# EAGLE design MotorShield (EAGLE 6.6.0)
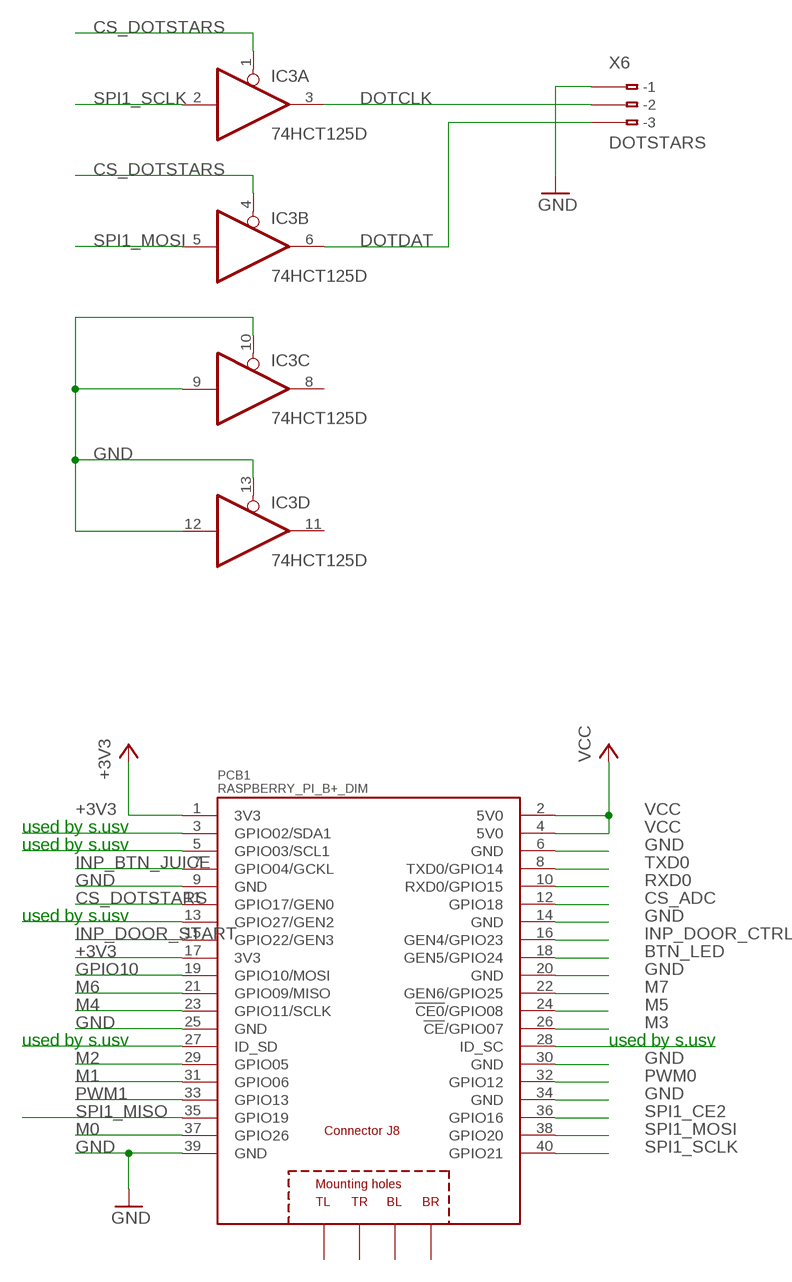
[diagram p0: schematic, sheet 1, part 1 of 2]
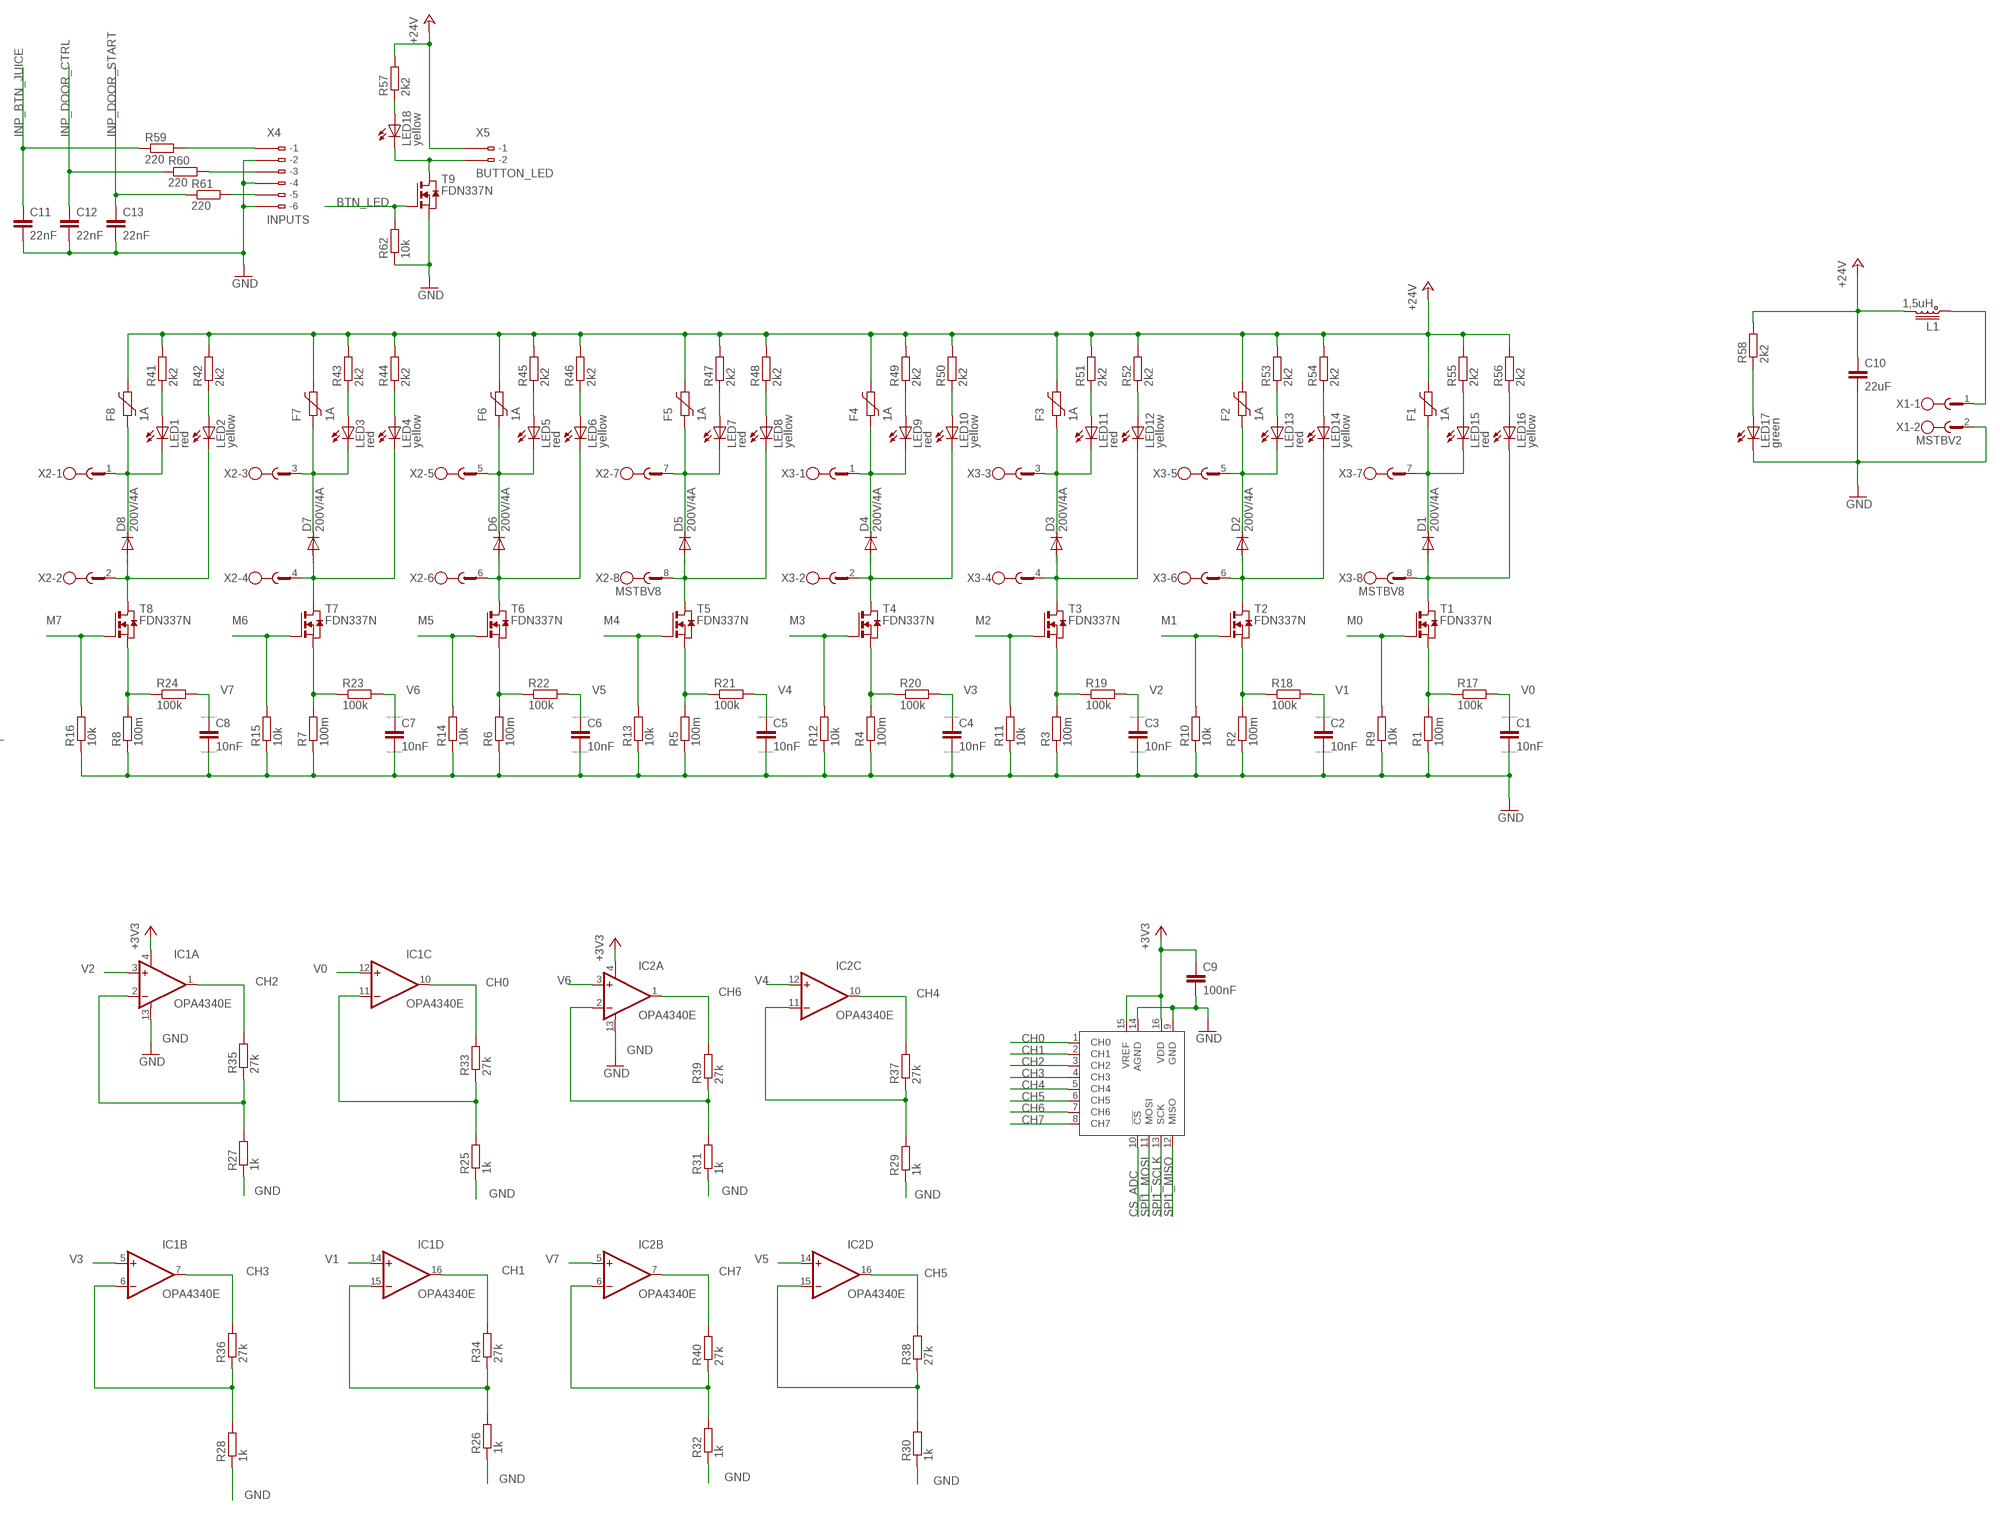
[diagram p1: schematic, sheet 1, part 2 of 2]

## Parts
C1  10nF  C  [C0805]
C2  10nF  C  [C0805]
C3  10nF  C  [C0805]
C4  10nF  C  [C0805]
C5  10nF  C  [C0805]
C6  10nF  C  [C0805]
C7  10nF  C  [C0805]
C8  10nF  C  [C0805]
C9  100nF  C-EUC0805  [C0805]
C10  22uF  C-EUC1812  [C1812]
C11  22nF  C-EUC0805K  [C0805K]
C12  22nF  C-EUC0805K  [C0805K]
C13  22nF  C-EUC0805K  [C0805K]
D1  200V/4A  DIODE-DO214AA  [DO214AA]
D2  200V/4A  DIODE-DO214AA  [DO214AA]
D3  200V/4A  DIODE-DO214AA  [DO214AA]
D4  200V/4A  DIODE-DO214AA  [DO214AA]
D5  200V/4A  DIODE-DO214AA  [DO214AA]
D6  200V/4A  DIODE-DO214AA  [DO214AA]
D7  200V/4A  DIODE-DO214AA  [DO214AA]
D8  200V/4A  DIODE-DO214AA  [DO214AA]
F1  1A  1812L  [1812L]
F2  1A  1812L  [1812L]
F3  1A  1812L  [1812L]
F4  1A  1812L  [1812L]
F5  1A  1812L  [1812L]
F6  1A  1812L  [1812L]
F7  1A  1812L  [1812L]
F8  1A  1812L  [1812L]
IC1  OPA4340E  [SSOP16BU]
IC2  OPA4340E  [SSOP16BU]
IC3  74HCT125D  [SO14]
IC4  MCP3008SL  [SO16]
L1  1,5uH  MPI4040R3-1R5-R  [MPI4040]
LED1  red  LEDCHIP-LED0805  [CHIP-LED0805]
LED2  yellow  LEDCHIP-LED0805  [CHIP-LED0805]
LED3  red  LEDCHIP-LED0805  [CHIP-LED0805]
LED4  yellow  LEDCHIP-LED0805  [CHIP-LED0805]
LED5  red  LEDCHIP-LED0805  [CHIP-LED0805]
LED6  yellow  LEDCHIP-LED0805  [CHIP-LED0805]
LED7  red  LEDCHIP-LED0805  [CHIP-LED0805]
LED8  yellow  LEDCHIP-LED0805  [CHIP-LED0805]
LED9  red  LEDCHIP-LED0805  [CHIP-LED0805]
LED10  yellow  LEDCHIP-LED0805  [CHIP-LED0805]
LED11  red  LEDCHIP-LED0805  [CHIP-LED0805]
LED12  yellow  LEDCHIP-LED0805  [CHIP-LED0805]
LED13  red  LEDCHIP-LED0805  [CHIP-LED0805]
LED14  yellow  LEDCHIP-LED0805  [CHIP-LED0805]
LED15  red  LEDCHIP-LED0805  [CHIP-LED0805]
LED16  yellow  LEDCHIP-LED0805  [CHIP-LED0805]
LED17  green  LEDCHIP-LED0805  [CHIP-LED0805]
LED18  yellow  LEDCHIP-LED0805  [CHIP-LED0805]
PCB1  RASPBERRY_PI_B+_DIM  [RASPBERRY_PI_BPLUS_DIM]
R1  100m  R-EU_R0805  [R0805]
R2  100m  R-EU_R0805  [R0805]
R3  100m  R-EU_R0805  [R0805]
R4  100m  R-EU_R0805  [R0805]
R5  100m  R-EU_R0805  [R0805]
R6  100m  R-EU_R0805  [R0805]
R7  100m  R-EU_R0805  [R0805]
R8  100m  R-EU_R0805  [R0805]
R9  10k  R-EU_R0805  [R0805]
R10  10k  R-EU_R0805  [R0805]
R11  10k  R-EU_R0805  [R0805]
R12  10k  R-EU_R0805  [R0805]
R13  10k  R-EU_R0805  [R0805]
R14  10k  R-EU_R0805  [R0805]
R15  10k  R-EU_R0805  [R0805]
R16  10k  R-EU_R0805  [R0805]
R17  100k  R-EU_R0805  [R0805]
R18  100k  R-EU_R0805  [R0805]
R19  100k  R-EU_R0805  [R0805]
R20  100k  R-EU_R0805  [R0805]
R21  100k  R-EU_R0805  [R0805]
R22  100k  R-EU_R0805  [R0805]
R23  100k  R-EU_R0805  [R0805]
R24  100k  R-EU_R0805  [R0805]
R25  1k  R-EU_R0805  [R0805]
R26  1k  R-EU_R0805  [R0805]
R27  1k  R-EU_R0805  [R0805]
R28  1k  R-EU_R0805  [R0805]
R29  1k  R-EU_R0805  [R0805]
R30  1k  R-EU_R0805  [R0805]
R31  1k  R-EU_R0805  [R0805]
R32  1k  R-EU_R0805  [R0805]
R33  27k  R-EU_R0805  [R0805]
R34  27k  R-EU_R0805  [R0805]
R35  27k  R-EU_R0805  [R0805]
R36  27k  R-EU_R0805  [R0805]
R37  27k  R-EU_R0805  [R0805]
R38  27k  R-EU_R0805  [R0805]
R39  27k  R-EU_R0805  [R0805]
R40  27k  R-EU_R0805  [R0805]
R41  2k2  R-EU_R0805  [R0805]
R42  2k2  R-EU_R0805  [R0805]
R43  2k2  R-EU_R0805  [R0805]
R44  2k2  R-EU_R0805  [R0805]
R45  2k2  R-EU_R0805  [R0805]
R46  2k2  R-EU_R0805  [R0805]
R47  2k2  R-EU_R0805  [R0805]
R48  2k2  R-EU_R0805  [R0805]
R49  2k2  R-EU_R0805  [R0805]
R50  2k2  R-EU_R0805  [R0805]
R51  2k2  R-EU_R0805  [R0805]
R52  2k2  R-EU_R0805  [R0805]
R53  2k2  R-EU_R0805  [R0805]
R54  2k2  R-EU_R0805  [R0805]
R55  2k2  R-EU_R0805  [R0805]
R56  2k2  R-EU_R0805  [R0805]
R57  2k2  R-EU_R0805  [R0805]
R58  2k2  R-EU_R0805  [R0805]
R59  220  R-EU_R0805  [R0805]
R60  220  R-EU_R0805  [R0805]
R61  220  R-EU_R0805  [R0805]
R62  10k  R-EU_R0805  [R0805]
T1  FDN337N  NMOSSOT23  [SOT-23]
T2  FDN337N  NMOSSOT23  [SOT-23]
T3  FDN337N  NMOSSOT23  [SOT-23]
T4  FDN337N  NMOSSOT23  [SOT-23]
T5  FDN337N  NMOSSOT23  [SOT-23]
T6  FDN337N  NMOSSOT23  [SOT-23]
T7  FDN337N  NMOSSOT23  [SOT-23]
T8  FDN337N  NMOSSOT23  [SOT-23]
T9  FDN337N  NMOSSOT23  [SOT-23]
X1  MSTBV2  [MSTBV2]
X2  MSTBV8  [MSTBV8]
X3  MSTBV8  [MSTBV8]
X4  INPUTS  233-506  [233-506]
X5  BUTTON_LED  233-502  [233-502]
X6  DOTSTARS  233-503  [233-503]

## Nets
+3V3: C9.1 IC1.4(A:V+) IC2.4(A:V+) IC4.15(VREF) IC4.16(VDD) PCB1.1(3V3) PCB1.17(3V3)
+24V [motor 2A]: C10.1 F1.2 F2.2 F3.2 F4.2 F5.2 F6.2 F7.2 F8.2 L1.2 R41.2 R42.2 R43.2 R44.2 R45.2 R46.2 R47.2 R48.2 R49.2 R50.2 R51.2 R52.2 R53.2 R54.2 R55.2 R56.2 R57.2 R58.2 X5.B1(B-1)
BTN_LED: PCB1.18(GEN5/GPIO24) R62.2 T9.3(G)
CH0: IC1.10(C:OUT) IC4.1(CH0) R33.2
CH1: IC1.16(D:OUT) IC4.2(CH1) R34.2
CH2: IC1.1(A:OUT) IC4.3(CH2) R35.2
CH3: IC1.7(B:OUT) IC4.4(CH3) R36.2
CH4: IC2.10(C:OUT) IC4.5(CH4) R37.2
CH5: IC2.16(D:OUT) IC4.6(CH5) R38.2
CH6: IC2.1(A:OUT) IC4.7(CH6) R39.2
CH7: IC2.7(B:OUT) IC4.8(CH7) R40.2
CS_ADC: IC4.10(!CS) PCB1.12(GPIO18)
CS_DOTSTARS: IC3.1(A:OE) IC3.4(B:OE) PCB1.11(GPIO17/GEN0)
D8 [motor 2A]: D8.C F8.1 LED1.C X2.1
DOTCLK: IC3.3(A:O) X6.B2(B-2)
DOTDAT: IC3.6(B:O) X6.B3(B-3)
GND: C1.2 C2.2 C3.2 C4.2 C5.2 C6.2 C7.2 C8.2 C9.2 C10.2 C11.2 C12.2 C13.2 IC1.13(A:V-) IC2.13(A:V-) IC3.9(C:I) IC3.10(C:OE) IC3.12(D:I) IC3.13(D:OE) IC4.9(GND) IC4.14(AGND) LED17.C PCB1.6(GND) PCB1.9(GND) PCB1.14(GND) PCB1.20(GND) PCB1.25(GND) PCB1.30(GND) PCB1.34(GND) PCB1.39(GND) R1.1 R2.1 R3.1 R4.1 R5.1 R6.1 R7.1 R8.1 R9.1 R10.1 R11.1 R12.1 R13.1 R14.1 R15.1 R16.1 R25.1 R26.1 R27.1 R28.1 R29.1 R30.1 R31.1 R32.1 R62.1 T9.2(S) X1.2 X4.B2(B-2) X4.B4(B-4) X4.B6(B-6) X6.B1(B-1)
GPIO10: PCB1.19(GPIO10/MOSI)
GPIO27: PCB1.13(GPIO27/GEN2)
INP_BTN_JUICE: C11.1 PCB1.7(GPIO04/GCKL) R59.1
INP_DOOR_CTRL: C12.1 PCB1.16(GEN4/GPIO23) R60.1
INP_DOOR_START: C13.1 PCB1.15(GPIO22/GEN3) R61.1
M0: PCB1.37(GPIO26) R9.2 T1.3(G)
M1: PCB1.31(GPIO06) R10.2 T2.3(G)
M2: PCB1.29(GPIO05) R11.2 T3.3(G)
M3: PCB1.26(!CE!/GPIO07) R12.2 T4.3(G)
M4: PCB1.23(GPIO11/SCLK) R13.2 T5.3(G)
M5: PCB1.24(!CE0!/GPIO08) R14.2 T6.3(G)
M6: PCB1.21(GPIO09/MISO) R15.2 T7.3(G)
M7: PCB1.22(GEN6/GPIO25) R16.2 T8.3(G)
N$2 [motor 2A]: D8.A LED2.C T8.1(D) X2.2
N$3 [motor 2A]: R8.2 R24.1 T8.2(S)
N$4 [motor 2A]: D1.C F1.1 LED15.C X3.7
N$5 [motor 2A]: D2.C F2.1 LED13.C X3.5
N$6: IC1.2(A:-IN) R27.2 R35.1
N$7 [motor 2A]: D3.C F3.1 LED11.C X3.3
N$8 [motor 2A]: D4.C F4.1 LED9.C X3.1
N$9 [motor 2A]: D5.C F5.1 LED7.C X2.7
N$10 [motor 2A]: D7.A LED4.C T7.1(D) X2.4
N$11 [motor 2A]: R7.2 R23.1 T7.2(S)
N$12 [motor 2A]: D6.C F6.1 LED5.C X2.5
N$13 [motor 2A]: D7.C F7.1 LED3.C X2.3
N$15: IC1.6(B:-IN) R28.2 R36.1
N$16: PCB1.3(GPIO02/SDA1)
N$17 [motor 2A]: D6.A LED6.C T6.1(D) X2.6
N$18 [motor 2A]: R6.2 R22.1 T6.2(S)
N$19: PCB1.27(ID_SD)
N$20: PCB1.28(ID_SC)
N$21: PCB1.5(GPIO03/SCL1)
N$22: IC1.11(C:-IN) R25.2 R33.1
N$23 [input 8A]: L1.1 X1.1
N$24: LED15.A R55.1
N$25: LED16.A R56.1
N$26 [motor 2A]: D5.A LED8.C T5.1(D) X2.8
N$27: IC1.15(D:-IN) R26.2 R34.1
N$28: LED1.A R41.1
N$29 [motor 2A]: R5.2 R21.1 T5.2(S)
N$30: LED2.A R42.1
N$31: IC2.2(A:-IN) R31.2 R39.1
N$32: LED18.C T9.1(D) X5.B2(B-2)
N$33: R59.2 X4.B1(B-1)
N$34: IC2.6(B:-IN) R32.2 R40.1
N$35: LED3.A R43.1
N$36: LED4.A R44.1
N$37: IC2.11(C:-IN) R29.2 R37.1
N$38 [motor 2A]: D4.A LED10.C T4.1(D) X3.2
N$39 [motor 2A]: R4.2 R20.1 T4.2(S)
N$40: IC2.15(D:-IN) R30.2 R38.1
N$41: LED6.A R46.1
N$42: LED5.A R45.1
N$43: LED7.A R47.1
N$44: LED8.A R48.1
N$45 [motor 2A]: D3.A LED12.C T3.1(D) X3.4
N$46 [motor 2A]: R3.2 R19.1 T3.2(S)
N$47: LED9.A R49.1
N$48: LED10.A R50.1
N$49: LED11.A R51.1
N$50: LED12.A R52.1
N$51 [motor 2A]: D2.A LED14.C T2.1(D) X3.6
N$52 [motor 2A]: R2.2 R18.1 T2.2(S)
N$53: LED13.A R53.1
N$54: LED14.A R54.1
N$57 [motor 2A]: D1.A LED16.C T1.1(D) X3.8
N$58 [motor 2A]: R1.2 R17.1 T1.2(S)
N$60: R60.2 X4.B3(B-3)
N$61: R61.2 X4.B5(B-5)
N$62: LED17.A R58.1
N$63: LED18.A R57.1
PWM0: PCB1.32(GPIO12)
PWM1: PCB1.33(GPIO13)
RXD0: PCB1.10(RXD0/GPIO15)
SPI1_CE2: PCB1.36(GPIO16)
SPI1_MISO: IC4.12(MISO) PCB1.35(GPIO19)
SPI1_MOSI: IC3.5(B:I) IC4.11(MOSI) PCB1.38(GPIO20)
SPI1_SCLK: IC3.2(A:I) IC4.13(SCK) PCB1.40(GPIO21)
TXD0: PCB1.8(TXD0/GPIO14)
V0: C1.1 IC1.12(C:+IN) R17.2
V1: C2.1 IC1.14(D:+IN) R18.2
V2: C3.1 IC1.3(A:+IN) R19.2
V3: C4.1 IC1.5(B:+IN) R20.2
V4: C5.1 IC2.12(C:+IN) R21.2
V5: C6.1 IC2.14(D:+IN) R22.2
V6: C7.1 IC2.3(A:+IN) R23.2
V7: C8.1 IC2.5(B:+IN) R24.2
VCC: PCB1.2(5V0) PCB1.4(5V0)
Unconnected: IC3.8(C:O) IC3.11(D:O) PCB1.PE_BL(BL) PCB1.PE_BR(BR) PCB1.PE_TL(TL) PCB1.PE_TR(TR) X4.A1(-1) X4.A2(-2) X4.A3(-3) X4.A4(-4) X4.A5(-5) X4.A6(-6) X5.A1(-1) X5.A2(-2) X6.A1(-1) X6.A2(-2) X6.A3(-3)

## Notes on the sheet
- used by s.usv
- used by s.usv
- used by s.usv
- used by s.usv | used by s.usv

## Power pins joined to a net without a drawn wire
GND: IC3.7(P:GND)
VCC: IC3.14(P:VCC)

## Library data of the parts
C1-C8 = eagle-ltspice:C: CAPACITOR, European symbol; SPICEMODEL: NONE; SPICEPREFIX: C
C9-C13 = rcl:C-EU: CAPACITOR, European symbol
D1-D8 = diode:DIODE-: DIODE
F1-F8 = ptc-littlefuse:1812L: FUSE
IC1 IC2 = burr-brown:OPA4340: Operational Amplifiers Source: http://focus.ti.com/lit/ds/sbos073/sbos073.pdf; MPN: OPA4340EA/250G4; OC_FARNELL: 1207061; OC_NEWARK: 67K8209
IC3 = 74xx-eu:74*125: Quad bus BUFFER, 3-state
IC4 = MCP3008:MCP3008
L1 = MPI4040:MPI4040R3-1R5-R: MPI4040R3-1R5-R; RS-COMPONENTS: 770-2738
LED1-LED18 = led:LED: LED OSRAM: - CHIPLED LG R971, LG N971, LY N971, LG Q971, LY Q971, LO R971, LY R971 LH N974, LH R974 LS Q976, LO Q976, LY Q976 LO Q996 - Hyper CHIPLED LW Q18S LB Q993, LB Q99A, LB R99A - SideLED LS A670, LO A670, LY A670, LG A670, LP A670 LB A673, LV A673, LT A673, LW A673 LH A674 LY A675 LS A676, LA A676, LO A676, LY A676, LW A676 LS A679, LY A679, LG A679 - Hyper Micro SIDELED® LS Y876, LA Y876, LO Y876, LY Y876 LT Y87S - SmartLED LW L88C, LW L88S LB L89C, LB L89S, LG L890 LS L89K, LO L89K, LY L89K LS L896, LA L896, LO L896, LY L896 - TOPLED LS T670, LO T670, LY T670, LG T670, LP T670 LSG T670, LSP T670, LSY T670, LOP T670, LYG T670 LG T671, LOG T671, LSG T671 LB T673, LV T673, LT T673, LW T673 LH T674 LS T676, LA T676, LO T676, LY T676, LB T676, LH T676, LSB T676, LW T676 LB T67C, LV T67C, LT T67C, LS T67K, LO T67K, LY T67K, LW E67C LS E67B, LA E67B, LO E67B, LY E67B, LB E67C, LV E67C, LT E67C LW T67C LS T679, LY T679, LG T679 LS T770, LO T770, LY T770, LG T770, LP T770 LB T773, LV T773, LT T773, LW T773 LH T774 LS E675, LA E675, LY E675, LS T675 LS T776, LA T776, LO T776, LY T776, LB T776 LHGB T686 LT T68C, LB T68C - Hyper Mini TOPLED® LB M676 - Mini TOPLED Santana® LG M470 LS M47K, LO M47K, LY M47K Source: http://www.osram.convergy.de LUXEON: - LUMILED® LXK2-PW12-R00, LXK2-PW12-S00, LXK2-PW14-U00, LXK2-PW14-V00 LXK2-PM12-R00, LXK2-PM12-S00, LXK2-PM14-U00 LXK2-PE12-Q00, LXK2-PE12-R00, LXK2-PE12-S00, LXK2-PE14-T00, LXK2-PE14-U00 LXK2-PB12-K00, LXK2-PB12-L00, LXK2-PB12-M00, LXK2-PB14-N00, LXK2-PB14-P00, LXK2-PB14-Q00 LXK2-PR12-L00, LXK2-PR12-M00, LXK2-PR14-Q00, LXK2-PR14-R00 LXK2-PD12-Q00, LXK2-PD12-R00, LXK2-PD12-S00 LXK2-PH12-R00, LXK2-PH12-S00 LXK2-PL12-P00, LXK2-PL12-Q00, LXK2-PL12-R00 Source: www.luxeon.com KINGBRIGHT: KA-3528ASYC Source: www.kingbright.com
PCB1 = RASPBERRY_PI_GPIO:RASPBERRY_PI_B+: Raspberry Pi B+ Basedon issue: Thursday, July 10, 2014 - Rev 1.2 LBR by Tim Rettmann 07-2014
R1-R62 = rcl:R-EU_: RESISTOR, European symbol
T1-T9 = zetex:NMOSSOT23: MOS FET; OC_FARNELL: unknown; OC_NEWARK: unknown
X1 = con-phoenix-508:MSTBV2: PHOENIX; MPN: MSTBV 2,5/2-GF-5.08; OC_FARNELL: 1792792; OC_NEWARK: 69R9845
X2 = con-phoenix-508:MSTBV8: PHOENIX; MPN: MSTBV 2,5/8-GF-5.08; OC_FARNELL: 1792797; OC_NEWARK: 69R9850
X3 = con-phoenix-508:MSTBV8: PHOENIX; MPN: MSTBV 2,5/8-GF-5.08; OC_FARNELL: 1792797; OC_NEWARK: 69R9850; REICHELT: RND 205-00392
X4 = con-wago:233-506: WAGO Cage Clamp; MF: Wago Corporation; MPN: 0233-0506; OC_FARNELL: 1777100; OC_NEWARK: 79K2052
X5 = con-wago:233-502: WAGO Cage Clamp; MPN: 233-502; OC_FARNELL: 1777096; OC_NEWARK: 58M2630
X6 = con-wago:233-503: WAGO Cage Clamp; MF: Wago Corporation; MPN: 0233-0503; OC_FARNELL: 1777097; OC_NEWARK: 79K2049

## Net classes
0 signal: width 0.254 mm, clearance 0.254 mm
1 motor 2A: width 0.813 mm
2 input 8A: width 2.54 mm

## Board
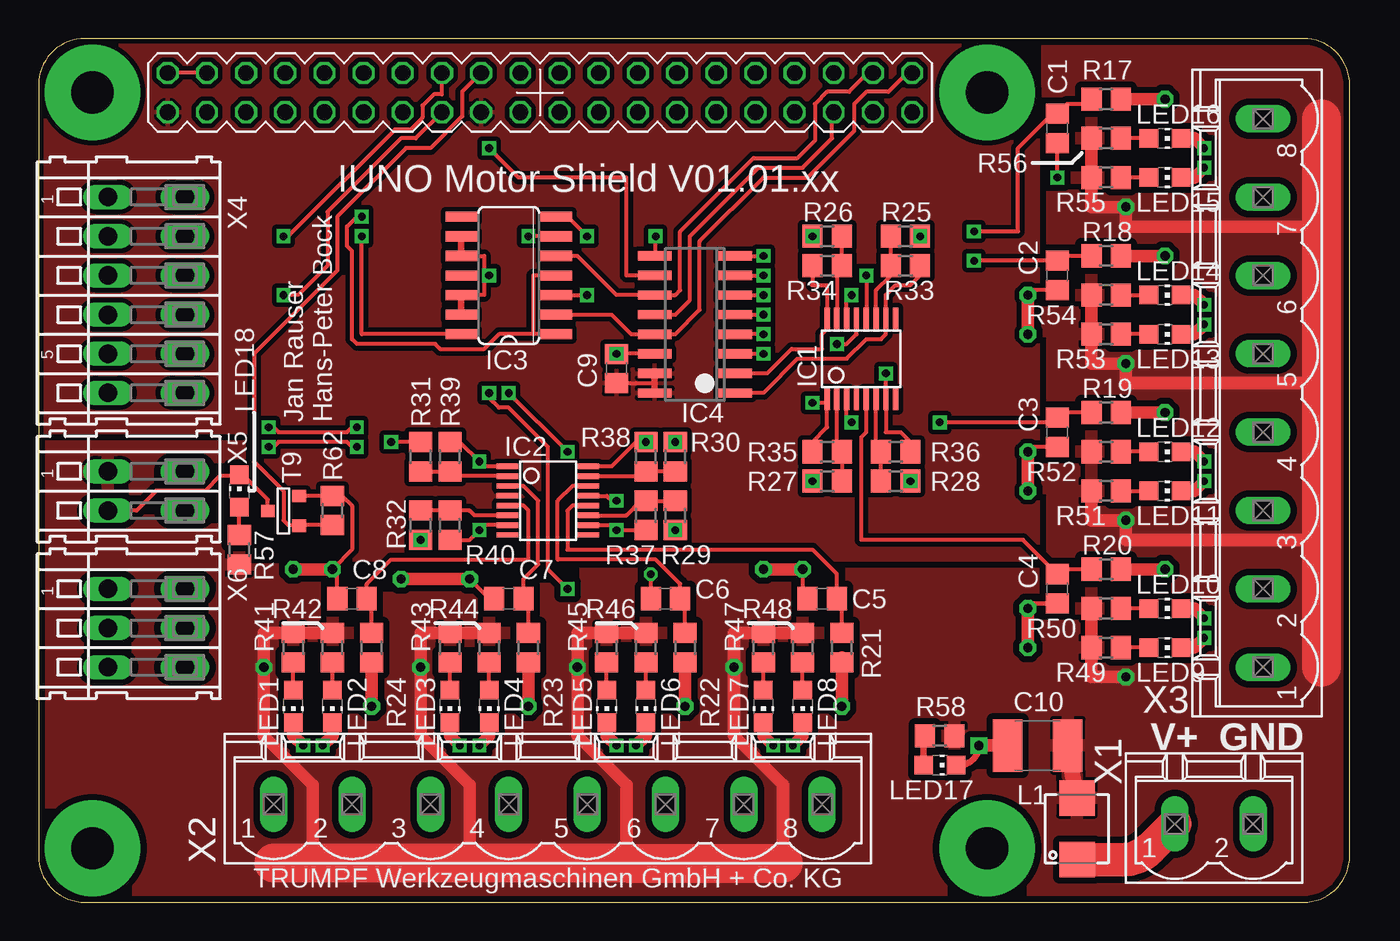
[diagram p2: board, top side]
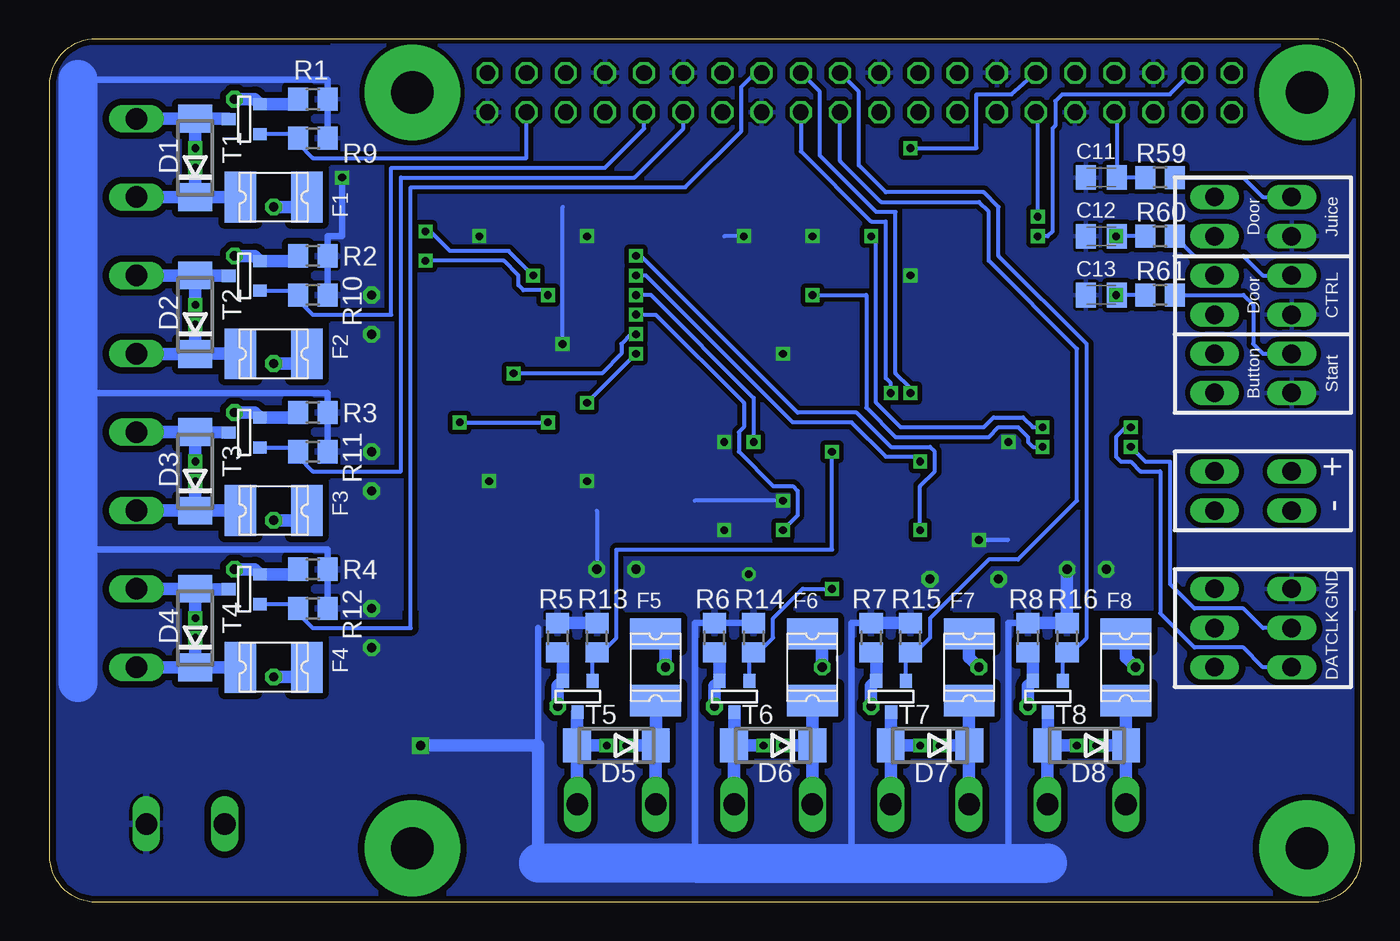
[diagram p3: board, bottom side, seen from below]

Size 85 x 56 mm. Coordinates in mm from the lower left corner, seen from the top.
Copper layers (1*16): Top 0.035mm / dielectric 1.5mm / Bottom 0.035mm
Design rules "PCB-POOL Standard": minimum track width 0.15mm, minimum drill 0.3mm, track to track 0.15mm, track to pad 0.15mm, pad to pad 0.15mm, via to via 0.15mm, smd to smd 0.15mm, copper to edge 0.3mm, drill to drill 0.2mm, minimum pad ring 0.2mm, minimum via ring 0.15mm, stop-mask expansion 0.075mm, vias tented up to drill 0mil, thermal gap 0.2mm

### Footprints (pad centres in the part's own frame; a part is rotated, then mirrored left to right if it is on the bottom)
C0805 = smd 1.3 x 1.5: 1 -0.95,0; 2 0.95,0
C1812 = smd 1.9 x 3.4: 1 -1.95,0; 2 1.95,0
C0805K = smd 1.3 x 1.6: 1 -1,0; 2 1,0
DO214AA = smd 1.8 x 2.2: A 2.55,0; C -2.55,0
1812L = smd 2.03 x 3.3: 1 -2.16,0; 2 2.16,0
SSOP16BU = smd 0.348 x 1.397: 1 -2.223,-2.619; 2 -1.588,-2.62; 3 -0.953,-2.62; 4 -0.318,-2.62; 5 0.318,-2.62; 6 0.953,-2.62; 7 1.588,-2.62; 8 2.223,-2.62; 9 2.223,2.62; 10 1.588,2.62; 11 0.953,2.62; 12 0.318,2.62; 13 -0.318,2.62; 14 -0.953,2.62; 15 -1.588,2.62; 16 -2.223,2.62
SO14 = smd 0.66 x 2.032: 1 -3.81,-3.073; 2 -2.54,-3.073; 3 -1.27,-3.073; 4 0,-3.073; 5 1.27,-3.073; 6 2.54,-3.073; 7 3.81,-3.073; 8 3.81,3.073; 9 2.54,3.073; 10 1.27,3.073; 11 0,3.073; 12 -1.27,3.073; 13 -2.54,3.073; 14 -3.81,3.073
SO16 = smd 0.6 x 2.2: 1 -4.445,-2.6; 2 -3.175,-2.6; 3 -1.905,-2.6; 4 -0.635,-2.6; 5 0.635,-2.6; 6 1.905,-2.6; 7 3.175,-2.6; 8 4.445,-2.6; 9 4.445,2.6; 10 3.175,2.6; 11 1.905,2.6; 12 0.635,2.6; 13 -0.635,2.6; 14 -1.905,2.6; 15 -3.175,2.6; 16 -4.445,2.6
MPI4040 = smd 2.3 x 2.3: 1 0,2; 2 0,-2
CHIP-LED0805 = smd 1.2 x 1.2: A 0,-1.05; C 0,1.05
RASPBERRY_PI_BPLUS_DIM = drill 1.016 octagon: 1 8.37,51.23; 2 8.37,53.77; 3 10.91,51.23; 4 10.91,53.77; 5 13.45,51.23; 6 13.45,53.77; 7 15.99,51.23; 8 15.99,53.77; 9 18.53,51.23; 10 18.53,53.77; 11 21.07,51.23; 12 21.07,53.77; 13 23.61,51.23; 14 23.61,53.77; 15 26.15,51.23; 16 26.15,53.77; 17 28.69,51.23; 18 28.69,53.77; 19 31.23,51.23; 20 31.23,53.77; 21 33.77,51.23; 22 33.77,53.77; 23 36.31,51.23; 24 36.31,53.77; 25 38.85,51.23; 26 38.85,53.77; 27 41.39,51.23; 28 41.39,53.77; 29 43.93,51.23; 30 43.93,53.77; 31 46.47,51.23; 32 46.47,53.77; 33 49.01,51.23; 34 49.01,53.77; 35 51.55,51.23; 36 51.55,53.77; 37 54.09,51.23; 38 54.09,53.77; 39 56.63,51.23; 40 56.63,53.77 | drill 2.75 pad 6.2: PE_BL 3.5,3.5; PE_BR 61.5,3.5; PE_TL 3.5,52.5; PE_TR 61.5,52.5
R0805 = smd 1.3 x 1.5: 1 -0.95,0; 2 0.95,0
SOT-23 = smd 0.787 x 0.889: 1 0.025,-1.016; 2 -0.94,1.016; 3 0.991,1.016
MSTBV2 = drill 1.397 long: 1 -2.54,0; 2 2.54,0
MSTBV8 = drill 1.397 long: 1 -17.78,0; 2 -12.7,0; 3 -7.62,0; 4 -2.54,0; 5 2.54,0; 6 7.62,0; 7 12.7,0; 8 17.78,0
233-506 = drill 1.2 long: A1 -6.35,2.5; A2 -3.81,2.5; A3 -1.27,2.5; A4 1.27,2.5; A5 3.81,2.5; A6 6.35,2.5; B1 -6.35,-2.5; B2 -3.81,-2.5; B3 -1.27,-2.5; B4 1.27,-2.5; B5 3.81,-2.5; B6 6.35,-2.5
233-502 = drill 1.2 long: A1 -1.27,2.5; A2 1.27,2.5; B1 -1.27,-2.5; B2 1.27,-2.5
233-503 = drill 1.2 long: A1 -2.54,2.5; A2 0,2.5; A3 2.54,2.5; B1 -2.54,-2.5; B2 0,-2.5; B3 2.54,-2.5

### Placement (x,y rotation side)
C1  66.04,50.16 270 top
C2  66.04,40.64 270 top
C3  66.04,30.48 270 top
C4  66.04,20.32 270 top
C5  50.8,19.68 180 top
C6  40.64,19.68 180 top
C7  30.48,19.68 180 top
C8  20.32,19.68 180 top
C9  37.47,34.61 90 top
C10  64.77,10.16 180 top
C11  16.83,46.99 180 bottom
C12  16.83,43.18 180 bottom
C13  16.83,39.37 180 bottom
D1  75.56,48.26 90 bottom
D2  75.56,38.1 90 bottom
D3  75.56,27.94 90 bottom
D4  75.56,17.78 90 bottom
D5  48.26,10.16 180 bottom
D6  38.1,10.16 180 bottom
D7  27.94,10.16 180 bottom
D8  17.78,10.16 180 bottom
F1  70.48,45.72 0 bottom
F2  70.48,35.56 0 bottom
F3  70.48,25.4 0 bottom
F4  70.48,15.24 0 bottom
F5  45.72,15.24 90 bottom
F6  35.56,15.24 90 bottom
F7  25.4,15.24 90 bottom
F8  15.24,15.24 90 bottom
IC1  53.34,35.24 0 top
IC2  33.02,26.04 270 top
IC3  30.48,40.64 90 top
IC4  42.55,37.47 90 top
L1  67.31,4.76 180 top
LED1  16.51,12.7 180 top
LED2  19.05,12.7 180 top
LED3  26.67,12.7 180 top
LED4  29.21,12.7 180 top
LED5  36.83,12.7 180 top
LED6  39.37,12.7 180 top
LED7  46.99,12.7 180 top
LED8  49.53,12.7 180 top
LED9  73.03,16.51 270 top
LED10  73.03,19.05 270 top
LED11  73.03,26.67 270 top
LED12  73.03,29.21 270 top
LED13  73.03,36.83 270 top
LED14  73.03,39.37 270 top
LED15  73.03,46.99 270 top
LED16  73.03,49.53 270 top
LED17  58.42,8.89 270 top
LED18  13.02,26.67 0 top
PCB1  0,0 0 top
R1  67.94,52.07 180 bottom
R2  67.94,41.91 180 bottom
R3  67.94,31.75 180 bottom
R4  67.94,21.59 180 bottom
R5  52.07,17.14 270 bottom
R6  41.91,17.14 270 bottom
R7  31.75,17.14 270 bottom
R8  21.59,17.14 270 bottom
R9  67.94,49.53 180 bottom
R10  67.94,39.37 180 bottom
R11  67.94,29.21 180 bottom
R12  67.94,19.05 180 bottom
R13  49.53,17.14 270 bottom
R14  39.37,17.14 270 bottom
R15  29.21,17.14 270 bottom
R16  19.05,17.14 270 bottom
R17  69.22,52.07 180 top
R18  69.22,41.91 180 top
R19  69.22,31.75 180 top
R20  69.22,21.59 180 top
R21  52.07,16.51 90 top
R22  41.91,16.51 90 top
R23  31.75,16.51 90 top
R24  21.59,16.51 90 top
R25  56.2,43.18 180 top
R26  51.12,43.18 0 top
R27  51.12,27.3 0 top
R28  55.56,27.3 180 top
R29  41.27,25.08 90 top
R30  41.27,28.89 270 top
R31  24.77,28.89 270 top
R32  24.77,24.45 90 top
R33  56.2,41.27 0 top
R34  51.12,41.27 180 top
R35  51.12,29.21 180 top
R36  55.56,29.21 0 top
R37  39.37,25.08 270 top
R38  39.37,28.89 90 top
R39  26.67,28.89 90 top
R40  26.67,24.45 270 top
R41  16.51,16.51 90 top
R42  19.05,16.51 90 top
R43  26.67,16.51 90 top
R44  29.21,16.51 90 top
R45  36.83,16.51 90 top
R46  39.37,16.51 90 top
R47  46.99,16.51 90 top
R48  49.53,16.51 90 top
R49  69.22,16.51 180 top
R50  69.22,19.05 180 top
R51  69.22,26.67 180 top
R52  69.22,29.21 180 top
R53  69.22,36.83 180 top
R54  69.22,39.37 180 top
R55  69.22,46.99 180 top
R56  69.22,49.53 180 top
R57  13.02,22.86 270 top
R58  58.42,10.79 0 top
R59  13.02,46.99 0 bottom
R60  13.02,43.18 0 bottom
R61  13.02,39.37 0 bottom
R62  19.05,25.4 270 top
T1  72.39,50.8 270 bottom
T2  72.39,40.64 270 bottom
T3  72.39,30.48 270 bottom
T4  72.39,20.32 270 bottom
T5  50.8,13.34 0 bottom
T6  40.64,13.34 0 bottom
T7  30.48,13.34 0 bottom
T8  20.32,13.34 0 bottom
T9  15.88,25.4 270 top
X1  76.2,5.08 0 top
X2  33.02,6.35 0 top
X3  79.38,33.02 90 top
X4  6.99,39.37 270 top
X5  6.99,26.67 270 top
X6  6.99,17.78 270 top

### Tracks (layer width: path | path; a pad name or v marks a point on that pad's centre or on a via)
+3V3
  Top 0.254: C9.1 39.94,33.66 39.95,33.66
  Top 0.406: IC4.16 39.95,33.66 IC4.15
  pour Top (isolate 0.305, rank 2): 3,55.88 61.77,55.88 arc-90 64.77,52.88 64.77,22.23 13.97,22.23 13.97,30.48 0,30.48 0,52.88 arc-90
+24V  (via drill 0.6)
  Top 0.813: 48.26,2.54 48.26,7.62 45.09,10.79 v45.09,15.24 45.09,17.46 R47.2 R48.2 | 38.1,2.54 38.1,7.62 34.92,10.79 v34.92,15.24 34.92,17.46 R45.2 R46.2 | R44.2 R43.2 24.77,17.46 v24.77,15.24 24.77,10.79 27.94,7.62 27.94,2.54 | 17.78,2.54 17.78,7.62 14.61,10.79 v14.61,15.24 14.61,17.46 R41.2 R42.2 | R50.2 R49.2 68.27,14.61 v70.48,14.61 | R54.2 R53.2 68.27,34.92 v70.48,34.92 70.48,33.66 83.19,33.66 | R51.2 68.27,24.77 v70.48,24.77 70.48,23.5 83.19,23.5 | R56.2 R55.2 68.27,45.09 v70.48,45.09 70.48,43.81 83.19,43.81
  Top 1.016: L1.2 66.67,10.16
  Top 2.54: 48.26,2.54 38.1,2.54 27.94,2.54 17.78,2.54 15.24,2.54 | 83.19,15.24 83.19,23.5 83.19,33.66 83.19,43.81 83.19,50.8
  Bottom 0.813: v34.92,15.24 34.92,16.77 F6.2 | v24.77,15.24 25.4,15.88 F7.2 | v14.61,15.24 15.24,15.88 F8.2 | F5.2 45.09,17.4 v45.09,15.24 | v70.48,14.61 68.33,14.61 F4.2 | F3.2 68.58,25.4 68.58,24.77 v70.48,24.77 | v70.48,34.92 68.33,34.92 F2.2 | F1.2 68.33,45.09 v70.48,45.09
  pour Top (isolate 0.406, rank 5): 0,29.84 13.34,29.84 13.34,21.59 65.41,21.59 65.41,55.88 81.92,55.88 arc-90 85.09,52.7 85.09,3.81 arc-90 81.28,0 3.17,0 arc-90 0,3.17
BTN_LED
  Top 0.254: PCB1.18 27.46,52.55 27.46,50.96 25.4,48.9 23.81,48.9 19.37,44.45 19.37,40.96 13.97,35.56 13.97,28.57 15.88,26.67 15.88,24.77 16.19,24.45 16.85,24.45 T9.3 16.93,24.45 R62.2
CH0
  Top 0.254: IC4.1 46.99,33.02 49.21,35.24 52.39,35.24 53.66,36.51 54.61,36.51 54.93,36.83 IC1.10 | IC1.10 54.93,39.05 | 54.93,39.05 | 54.93,39.05 54.93,39.37 55.56,40.01 56.52,40.01 57.15,40.64 R33.2 | IC1.10
CH1
  Top 0.254: R34.2 50.16,40.01 51.12,40.01 IC1.16 | IC4.2 47.23,34.29 48.81,35.88 50.8,35.88 50.8,36.83 51.12,37.15 IC1.16 | IC1.16
CH2  (via drill 0.5)
  Top 0.254: R35.2 50.17,29.85 51.12,30.8 IC1.1 51.12,32.38 v50.16,32.38 | IC4.3 v46.99,35.56
  Bottom 0.254: v46.99,35.56 v50.16,32.38
CH3  (via drill 0.5)
  Top 0.254: R36.2 56.52,29.84 55.88,30.48 54.93,30.48 | v46.99,36.83 IC4.4 | v54.93,34.29 IC1.7 54.93,30.48 | 54.93,30.48
  Bottom 0.254: v46.99,36.83 47.31,36.83 47.94,36.2 47.94,35.56 49.21,34.29 v54.93,34.29
CH4  (via drill 0.5)
  Top 0.254: IC2.10 37.15,24.45 v37.46,24.13 v37.47,24.13 | v37.47,24.13 | IC4.5 v46.99,38.1 | v37.47,24.13 R37.2
  Bottom 0.254: v46.99,38.1 45.72,38.1 40.01,32.38 40.01,30.8 40.32,30.48 40.32,29.21 38.1,26.99 36.83,26.99 36.51,26.67 36.51,25.08 v37.47,24.13 | v37.47,24.13
CH5  (via drill 0.5)
  Top 0.254: IC4.6 v46.99,39.37 | R38.2 38.73,29.84 37.15,28.26 IC2.16
  Bottom 0.254: v46.99,39.37 46.04,39.37 39.37,32.7 R38.2
  other vias: 39.37,29.84
CH6  (via drill 0.5)
  Top 0.254: IC2.1 28.89,28.26 v28.57,28.57 27.31,29.84 R39.2 | IC4.7 v46.99,40.64
  Bottom 0.254: 46.67,40.64 v46.99,40.64 46.35,40.64 36.83,31.11 33.02,31.11 30.8,28.89 28.89,28.89 v28.57,28.57
CH7  (via drill 0.5)
  Top 0.254: IC2.7 28.89,24.45 v28.57,24.13 27.94,23.5 R40.2 | IC4.8 v46.99,41.91
  Bottom 0.254: v28.57,24.13 28.57,26.99 27.62,27.94 27.62,29.21 27.94,29.53 30.48,29.53 32.7,31.75 36.51,31.75 46.67,41.91 v46.99,41.91
CS_ADC  (via drill 0.5)
  Top 0.254: IC4.10 38.1,40.64 38.1,46.99 31.11,46.99 v29.21,48.9
  Bottom 0.254: v29.21,48.9 24.92,48.9 24.92,52.39 22.66,52.39 PCB1.12
CS_DOTSTARS  (via drill 0.5)
  Top 0.254: IC3.4 32.07,40.64 32.07,36.83 | IC3.1 32.07,36.83 | 32.07,36.83 29.84,36.83 28.89,35.88 26.04,35.88 25.72,36.2 20.64,36.2 20.32,36.51 20.32,42.23 20,42.55 20,43.81 20.64,44.45 v20.95,44.45
  Bottom 0.254: v20.95,44.45 20.95,51.12 PCB1.11
D8  (via drill 0.5)
  Top 0.813: LED1.C 16.51,10.79 v17.14,10.16
  Bottom 0.406: D8.C
  Bottom 0.813: X2.1 D8.C | D8.C v17.14,10.16 | F8.1 D8.C
DOTCLK  (via drill 0.5)
  Top 0.254: IC3.3 v35.56,39.37 | v20.64,29.53 20.32,29.53 20,29.84 15.56,29.84 15.24,29.53 v14.92,29.53
  Bottom 0.254: v35.56,39.37 32.07,39.37 32.07,32.07 30.16,30.16 24.13,30.16 23.5,30.8 22.23,30.8 21.59,30.16 21.59,29.84 21.27,29.53 v20.64,29.53 | v14.92,29.53 13.97,28.57 12.38,28.57 12.38,20.64 10.79,19.05 7.62,19.05 6.35,17.78 X6.B2
DOTDAT  (via drill 0.5)
  Top 0.254: IC3.6 v31.75,43.18 | v14.92,30.8 15.24,30.8 15.56,30.48 20,30.48 20.32,30.8 v20.64,30.8
  Bottom 0.254: v31.75,43.18 31.43,43.18 31.43,32.38 29.84,30.8 24.45,30.8 23.81,31.43 21.91,31.43 21.27,30.8 v20.64,30.8 | v14.92,30.8 15.24,30.8 15.88,30.16 15.88,28.89 15.56,28.57 14.92,28.57 14.29,27.94 13.02,27.94 13.02,18.73 10.79,16.51 7.62,16.51 6.35,15.24 X6.B3
GND  (via drill 0.5, 0.6)
  Top 0.254: v49.53,21.59 49.53,19.37 | R30.1 | R31.1 v22.86,29.84 | R27.1 v50.16,27.3 | v66.04,46.99 C1.2 | R32.1 | IC3.10 28.89,41.91 28.89,40.64 | 28.89,40.64 28.89,39.37 IC3.12 | 40.01,42.05 arc-45 IC4.9 arc45 40.01,42.05 | 40.01,42.05 v40.01,43.18 | IC3.7 34.29,44.45 v35.56,43.18 | v51.75,36.2 52.39,36.2 53.02,36.83 IC1.13 | C7.2 29.21,19.68 v27.94,20.95 | C8.2 19.37,21.27 v19.05,21.59 20.32,22.86 20.32,25.72 19.69,26.35 R62.1 T9.2 | C2.2 64.45,39.69 v64.14,39.37 | C3.2 64.45,29.53 v64.14,29.21 | IC4.14 38.1,35.56 C9.2 | C9.2 | C6.2 v39.69,21.27 | IC2.13 36.83,26.35 37.15,26.04 v37.47,26.04 | v29.21,40.64 28.89,40.64 | R29.1 | v50.16,43.18 R26.1 | R25.1 | v56.52,27.3 R28.1 | C9.2
  Top 0.305: C4.2 64.45,19.37 v64.14,19.05
  Top 0.406: 49.53,19.37 49.85,19.37 C5.2 | 27.37,38.06 IC3.13 IC3.12 | IC3.9 IC3.10 | LED17.C 59.69,8.89 arc90 v60.96,10.16
  Top 0.813: v49.53,21.59 v46.99,21.59 | v27.94,20.95 v23.5,20.95 | v19.05,21.59 v16.51,21.59 | v64.14,19.05 v64.14,16.51 | v64.14,26.67 v64.14,29.21 | v64.14,36.83 v64.14,39.37 | C10.2 v60.96,10.16
  Bottom 0.254: v51.75,36.2 51.75,45.09 | 49.53,25.4 v49.53,21.59 | R32.1 22.86,23.5 R32.1 | v37.47,26.04 43.18,26.04 | v40.01,43.18 41.27,43.18
  Bottom 0.406: 53.34,17.78 53.34,10.16 | R14.1 R6.1 43.18,18.09 43.18,2.54 | R7.1 33.02,18.09 33.02,2.54 | R8.1 22.86,18.09 22.86,2.54 | 83.19,22.86 67,22.86 R4.1 R12.1 | 83.19,53.34 67,53.34 R1.1 67,50.17 66.67,49.85 R9.1 | 83.19,33.02 67,33.02 R3.1 R11.1 | v66.04,46.99 66.04,43.18 67,43.18 R2.1 R10.1
  Bottom 0.813: R5.1 R13.1 | R8.1 R16.1 v19.05,21.59 | R7.1 R15.1 | v60.96,10.16 53.34,10.16 53.34,2.54
  Bottom 2.54: 53.34,2.54 43.18,2.54 33.02,2.54 22.86,2.54 20.32,2.54 | 83.19,53.34 83.19,33.02 83.19,14.24
  other vias: 41.27,29.84 24.77,23.5 57.15,43.18 41.27,24.13 37.47,35.56
  pour Bottom (isolate 0.406, rank 5): 85.09,3.81 85.09,52.7 arc90 81.92,55.88 66.67,55.88 66.04,19.68 0,19.68 0,3.17 arc90 3.17,0 81.28,0 arc90
  pour Bottom (isolate 0.305, rank 2): 3.81,55.88 66.67,55.88 66.67,19.05 0,19.05 0,55.88
  pour Top (isolate 0.406): 38.73,34.29 40.96,34.29 40.96,33.02 38.73,33.02
INP_BTN_JUICE
  Bottom 0.254: R59.1 C11.1 15.83,51.07 PCB1.7
INP_DOOR_CTRL  (via drill 0.5)
  Top 0.254: PCB1.16 26.15,52.39 25.63,52.39 24.89,51.65 24.89,50.87 24.11,50.09 23.11,50.09 16.19,43.18 v15.88,43.18
  Bottom 0.254: R60.1 C12.1 v15.88,43.18
INP_DOOR_START  (via drill 0.5)
  Top 0.254: PCB1.15 24.45,49.53 23.5,49.53 18.73,44.77 18.73,41.27 16.83,39.37 v15.88,39.37 C13.1
  Bottom 0.254: R61.1 C13.1 v15.88,39.37
M0
  Bottom 0.254: T1.3 69.17,49.81 R9.2 68.89,49.22 68.9,49.21 67.94,48.26 54.09,48.26 PCB1.37
M1
  Bottom 0.254: T2.3 69.17,39.65 R10.2 68.89,39.05 68.9,39.05 67.94,38.1 62.87,38.1 62.87,47.62 49.01,47.62 46.47,50.16 PCB1.31
M2
  Bottom 0.254: T3.3 69.17,29.49 R11.2 68.89,28.89 68.9,28.89 67.94,27.94 62.23,27.94 62.23,46.99 47.1,46.99 43.93,50.16 PCB1.29
M3
  Bottom 0.254: T4.3 69.17,19.33 R12.2 68.89,18.73 67.94,17.78 61.59,17.78 61.59,46.35 43.81,46.35 40.16,50.01 40.16,52.86 39.26,53.77 PCB1.26
M4  (via drill 0.5)
  Top 0.254: v34.29,29.21 v30.48,33.02
  Bottom 0.254: T5.3 49.81,15.92 R13.2 49.22,16.2 49.21,16.19 48.26,17.15 48.26,22.86 34.29,22.86 v34.29,29.21 | v30.48,33.02 30.48,33.66 30.8,33.97 30.8,44.13 31.75,44.13 36.31,48.69 PCB1.23
M5  (via drill 0.5)
  Top 0.254: v34.29,20.32 33.02,21.59 33.02,29.53 30.48,32.07 29.84,32.07 29.21,32.7 v29.21,33.02
  Bottom 0.254: T6.3 39.65,15.92 R14.2 39.05,16.2 38.1,17.14 38.1,18.41 36.2,20.32 v34.29,20.32 | v29.21,33.02 29.21,33.34 30.16,34.29 30.16,44.77 31.43,44.77 35.08,48.42 35.08,52.54 PCB1.24
M6
  Bottom 0.254: T7.3 29.49,15.92 R15.2 28.89,16.2 27.94,17.15 27.94,18.41 24.13,22.23 22.23,22.23 18.41,26.04 18.41,35.88 24.13,41.59 24.13,44.77 24.77,45.4 31.11,45.4 33.77,48.06 PCB1.21
M7
  Bottom 0.254: T8.3 19.33,15.92 R16.2 18.73,16.2 17.78,17.14 17.78,36.2 23.5,41.91 23.5,45.09 24.45,46.04 30.8,46.04 32.54,47.78 32.54,52.54 PCB1.22
N$2  (via drill 0.5)
  Top 0.813: LED2.C 19.05,10.79 v18.41,10.16
  Bottom 0.406: D8.A
  Bottom 0.813: X2.2 D8.A | v18.41,10.16 D8.A 20.3,10.2 T8.1
N$3  (via drill 0.6)
  Top 0.813: R24.1 v21.59,12.7
  Bottom 0.813: R8.2 21.26,15.89 T8.2 21.59,14.02 v21.59,12.7
N$4  (via drill 0.5)
  Top 0.813: LED15.C 74.93,46.99 v75.56,47.62
  Bottom 0.813: X3.7 75.58,45.72 D1.C | D1.C 72.66,45.71 F1.1 | v75.56,47.62 D1.C
N$5  (via drill 0.5)
  Top 0.813: LED13.C 74.93,36.83 v75.56,37.47
  Bottom 0.813: X3.5 D2.C | D2.C F2.1 | v75.56,37.47 D2.C
N$6
  Top 0.254: IC1.2 51.75,29.21 R35.1 R27.2
N$7  (via drill 0.5)
  Top 0.813: LED11.C 74.93,26.67 v75.56,27.3
  Bottom 0.813: X3.3 79.36,25.39 D3.C | D3.C F3.1 | v75.56,27.3 D3.C
N$8  (via drill 0.5)
  Top 0.813: LED9.C 74.93,16.51 v75.56,17.14
  Bottom 0.813: X3.1 79.36,15.23 D4.C | D4.C F4.1 | v75.56,17.14 D4.C
N$9  (via drill 0.5)
  Top 0.813: LED7.C 46.99,10.79 v47.62,10.16
  Bottom 0.406: F5.1 | D5.C
  Bottom 0.813: F5.1 D5.C v47.62,10.16 | X2.7 D5.C
N$10  (via drill 0.5)
  Top 0.813: LED4.C 29.21,10.79 v28.57,10.16
  Bottom 0.406: D7.A
  Bottom 0.813: X2.4 D7.A | v28.57,10.16 D7.A 30.45,10.2 T7.1
N$11  (via drill 0.6)
  Top 0.813: R23.1 v31.75,12.7
  Bottom 0.813: R7.2 31.42,15.89 T7.2 31.75,14.02 v31.75,12.7
N$12  (via drill 0.5)
  Top 0.813: LED5.C 36.83,10.79 v37.47,10.16
  Bottom 0.406: D6.C
  Bottom 0.813: X2.5 D6.C | D6.C v37.47,10.16 | F6.1 D6.C
N$13  (via drill 0.5)
  Top 0.813: LED3.C 26.67,10.79 v27.3,10.16
  Bottom 0.406: D7.C
  Bottom 0.813: X2.3 D7.C | D7.C v27.3,10.16 | F7.1 D7.C
N$15
  Top 0.254: IC1.6 54.29,29.21 R36.1 R28.2
N$17  (via drill 0.5)
  Top 0.813: LED6.C 39.37,10.79 v38.73,10.16
  Bottom 0.406: 40.62,10.2 D6.A
  Bottom 0.813: v38.73,10.16 D6.A | T6.1 40.62,10.2 | X2.6 D6.A
N$18  (via drill 0.6)
  Top 0.813: R22.1 v41.91,12.7
  Bottom 0.813: R6.2 41.58,15.89 T6.2 41.91,14.02 v41.91,12.7
N$22
  Top 0.254: R25.2 R33.1 55.24,40.64 54.29,39.69 IC1.11
N$23
  Top 2.184: X1.1 72.09,3.51 arc-45 70.29,2.76 L1.1
N$24
  Top 0.254: LED15.A R55.1
N$25
  Top 0.254: LED16.A R56.1
N$26  (via drill 0.5)
  Top 0.813: LED8.C 49.53,10.79 v48.9,10.16
  Bottom 0.406: T5.1 50.81,12.32 | X2.8
  Bottom 0.813: 50.81,12.32 D5.A | X2.8 D5.A | v48.9,10.16 D5.A
N$27
  Top 0.254: IC1.15 51.75,41.27 R34.1 R26.2
N$28
  Top 0.254: LED1.A R41.1
N$29  (via drill 0.6)
  Top 0.813: 52.07,15.88 R21.1 v52.07,12.7
  Bottom 0.813: R5.2 51.74,15.89 T5.2 52.07,14.02 v52.07,12.7
N$30
  Top 0.254: LED2.A R42.1
N$31
  Top 0.254: IC2.2 26.99,27.62 R39.1 R31.2
N$32
  Top 0.254: T9.1 14.86,26.1 13.34,27.62 12.7,27.62 | 12.7,27.62 11.75,27.62 10.79,26.67 7.62,26.67 6.35,25.4 X5.B2 | LED18.C 12.7,27.62
N$33
  Bottom 0.254: X4.B1 6.35,45.72 7.62,46.99 R59.2
N$34
  Top 0.254: R32.2 R40.1 27.94,25.4 28.26,25.08 IC2.6
N$35
  Top 0.254: LED3.A R43.1
N$36
  Top 0.254: LED4.A R44.1
N$37
  Top 0.254: IC2.11 38.1,25.08 39.05,26.04 39.05,26.03 R37.1 R29.2
N$38  (via drill 0.5)
  Top 0.813: LED10.C 74.93,19.05 v75.56,18.41
  Bottom 0.813: X3.2 79.36,20.33 D4.A | D4.A 75.53,20.3 T4.1 | v75.56,18.41 D4.A
N$39  (via drill 0.6)
  Top 0.813: R20.1 v73.03,21.59
  Bottom 0.813: R4.2 69.22,21.26 T4.2 71.7,21.59 v73.03,21.59
N$40
  Top 0.254: IC2.15 39.05,27.62 R38.1 R30.2
N$41
  Top 0.254: LED6.A R46.1
N$42
  Top 0.254: LED5.A R45.1
N$43
  Top 0.254: LED7.A R47.1
N$44
  Top 0.254: LED8.A R48.1
N$45  (via drill 0.5)
  Top 0.813: LED12.C 74.93,29.21 v75.56,28.57
  Bottom 0.813: v75.56,28.57 D3.A | X3.4 75.58,30.48 D3.A | T3.1 D3.A
N$46  (via drill 0.6)
  Top 0.813: R19.1 v73.03,31.75
  Bottom 0.813: R3.2 69.22,31.42 T3.2 71.7,31.75 v73.03,31.75
N$47
  Top 0.254: LED9.A R49.1
N$48
  Top 0.254: LED10.A R50.1
N$49
  Top 0.254: R51.1 LED11.A
N$50
  Top 0.254: LED12.A R52.1
N$51  (via drill 0.5)
  Top 0.813: LED14.C 74.93,39.37 v75.56,38.73
  Bottom 0.813: v75.56,38.73 D2.A | X3.6 75.58,40.64 D2.A | T2.1 75.53,40.62 D2.A
N$52  (via drill 0.6)
  Top 0.813: R18.1 v73.03,41.91
  Bottom 0.813: R2.2 69.22,41.58 T2.2 71.7,41.91 v73.03,41.91
N$53
  Top 0.254: LED13.A R53.1
N$54
  Top 0.254: R54.1 LED14.A
N$57  (via drill 0.5)
  Top 0.813: LED16.C 74.93,49.53 v75.56,48.9
  Bottom 0.813: v75.56,48.9 D1.A | X3.8 75.58,50.8 D1.A | D1.A 73.44,50.81 T1.1
N$58  (via drill 0.6)
  Top 0.813: R17.1 v73.03,52.07
  Bottom 0.813: R1.2 69.22,51.74 T1.2 71.7,52.07 v73.03,52.07
N$60
  Bottom 0.254: X4.B3 6.35,40.64 7.62,41.91 10.79,41.91 R60.2
N$61
  Bottom 0.254: X4.B5 6.35,35.56 6.99,36.2 6.99,38.73 7.62,39.37 R61.2
N$62
  Top 0.406: LED17.A 57.37,11.33 R58.1
N$63
  Top 0.254: R57.1 LED18.A
SPI1_MISO
  Top 0.254: IC4.12 41.27,38.1 42.23,39.05 42.23,43.18 46.67,47.62 49.53,47.62 51.44,49.53 51.44,51.12 PCB1.35
SPI1_MOSI
  Top 0.254: IC3.5 34.92,41.91 37.47,39.37 IC4.11 41.27,39.37 41.59,39.69 41.59,43.5 46.35,48.26 49.21,48.26 50.32,49.37 50.32,51.75 51.12,52.55 52.55,52.55 53.77,53.77 PCB1.38
SPI1_SCLK
  Top 0.254: IC3.2 37.15,38.1 38.42,36.83 IC4.13 41.27,36.83 42.86,38.42 42.86,42.86 46.99,46.99 49.85,46.99 52.86,50.01 52.86,51.75 53.66,52.55 55.09,52.55 56.31,53.77 PCB1.40
V0  (via drill 0.5)
  Top 0.254: R17.2 68.27,51.75 66.67,51.75 C1.1 65.72,51.12 63.5,48.9 63.5,43.5 v60.64,43.5 | v53.66,40.64 53.66,40.32 IC1.12
  Bottom 0.254: v53.66,40.64 55.24,42.23 59.05,42.23 60.33,43.5 v60.64,43.5
V1  (via drill 0.5)
  Top 0.254: IC1.14 52.39,39.05 v52.7,39.37 | R18.2 66.36,41.91 C2.1 66.67,41.59 v60.64,41.59
  Bottom 0.254: v52.7,39.37 53.02,39.69 54.29,39.69 54.61,40.01 54.61,40.64 55.56,41.59 v60.64,41.59
V2  (via drill 0.5)
  Top 0.254: v58.42,31.11 66.36,31.11 C3.1 66.36,31.75 R19.2 | v52.7,31.11 52.39,31.11 IC1.3
  Bottom 0.254: v58.42,31.11 v52.7,31.11
V3
  Top 0.254: C4.1 66.67,21.59 | IC1.5 53.66,30.48 53.34,30.16 53.34,23.5 63.81,23.5 C4.1 | R20.2 66.36,21.59 C4.1
V4
  Top 0.254: IC2.12 34.61,25.72 34.29,25.4 34.29,22.86 50.16,22.86 51.75,21.27 C5.1 52.07,19.36 R21.2
V5
  Top 0.254: IC2.14 34.61,26.99 33.66,26.04 33.66,22.23 40.01,22.23 41.59,20.64 C6.1 41.91,19.36 R22.2
V6
  Top 0.254: IC2.3 31.43,26.99 32.38,26.04 32.38,21.91 31.43,20.95 C7.1 31.75,19.36 R23.2
V7
  Top 0.254: IC2.5 31.43,25.72 31.75,25.4 31.75,22.23 22.86,22.23 21.27,20.64 C8.1 21.59,19.36 R24.2
VCC  (via drill 0.5)
  Top 0.254: IC3.14 20.95,36.83 v20.95,43.18 | PCB1.4 PCB1.2
  Bottom 0.254: PCB1.4 11,53.77 12.38,52.39 19.37,52.39 19.81,51.94 19.81,50.35 20,50.16 20,43.5 20.32,43.18 v20.95,43.18

### Text on the board
tPlace: Jan Rauser / Hans-Peter Bock | V+ | GND | TRUMPF Werkzeugmaschinen GmbH + Co. KG
bPlace: Juice | Door | CTRL | Door | Start | Button | + | - | GND | CLK | DAT
tNames: IUNO Motor Shield V01.01.xx